# EAGLE design Sequencer_RevB (EAGLE 7.3.0)
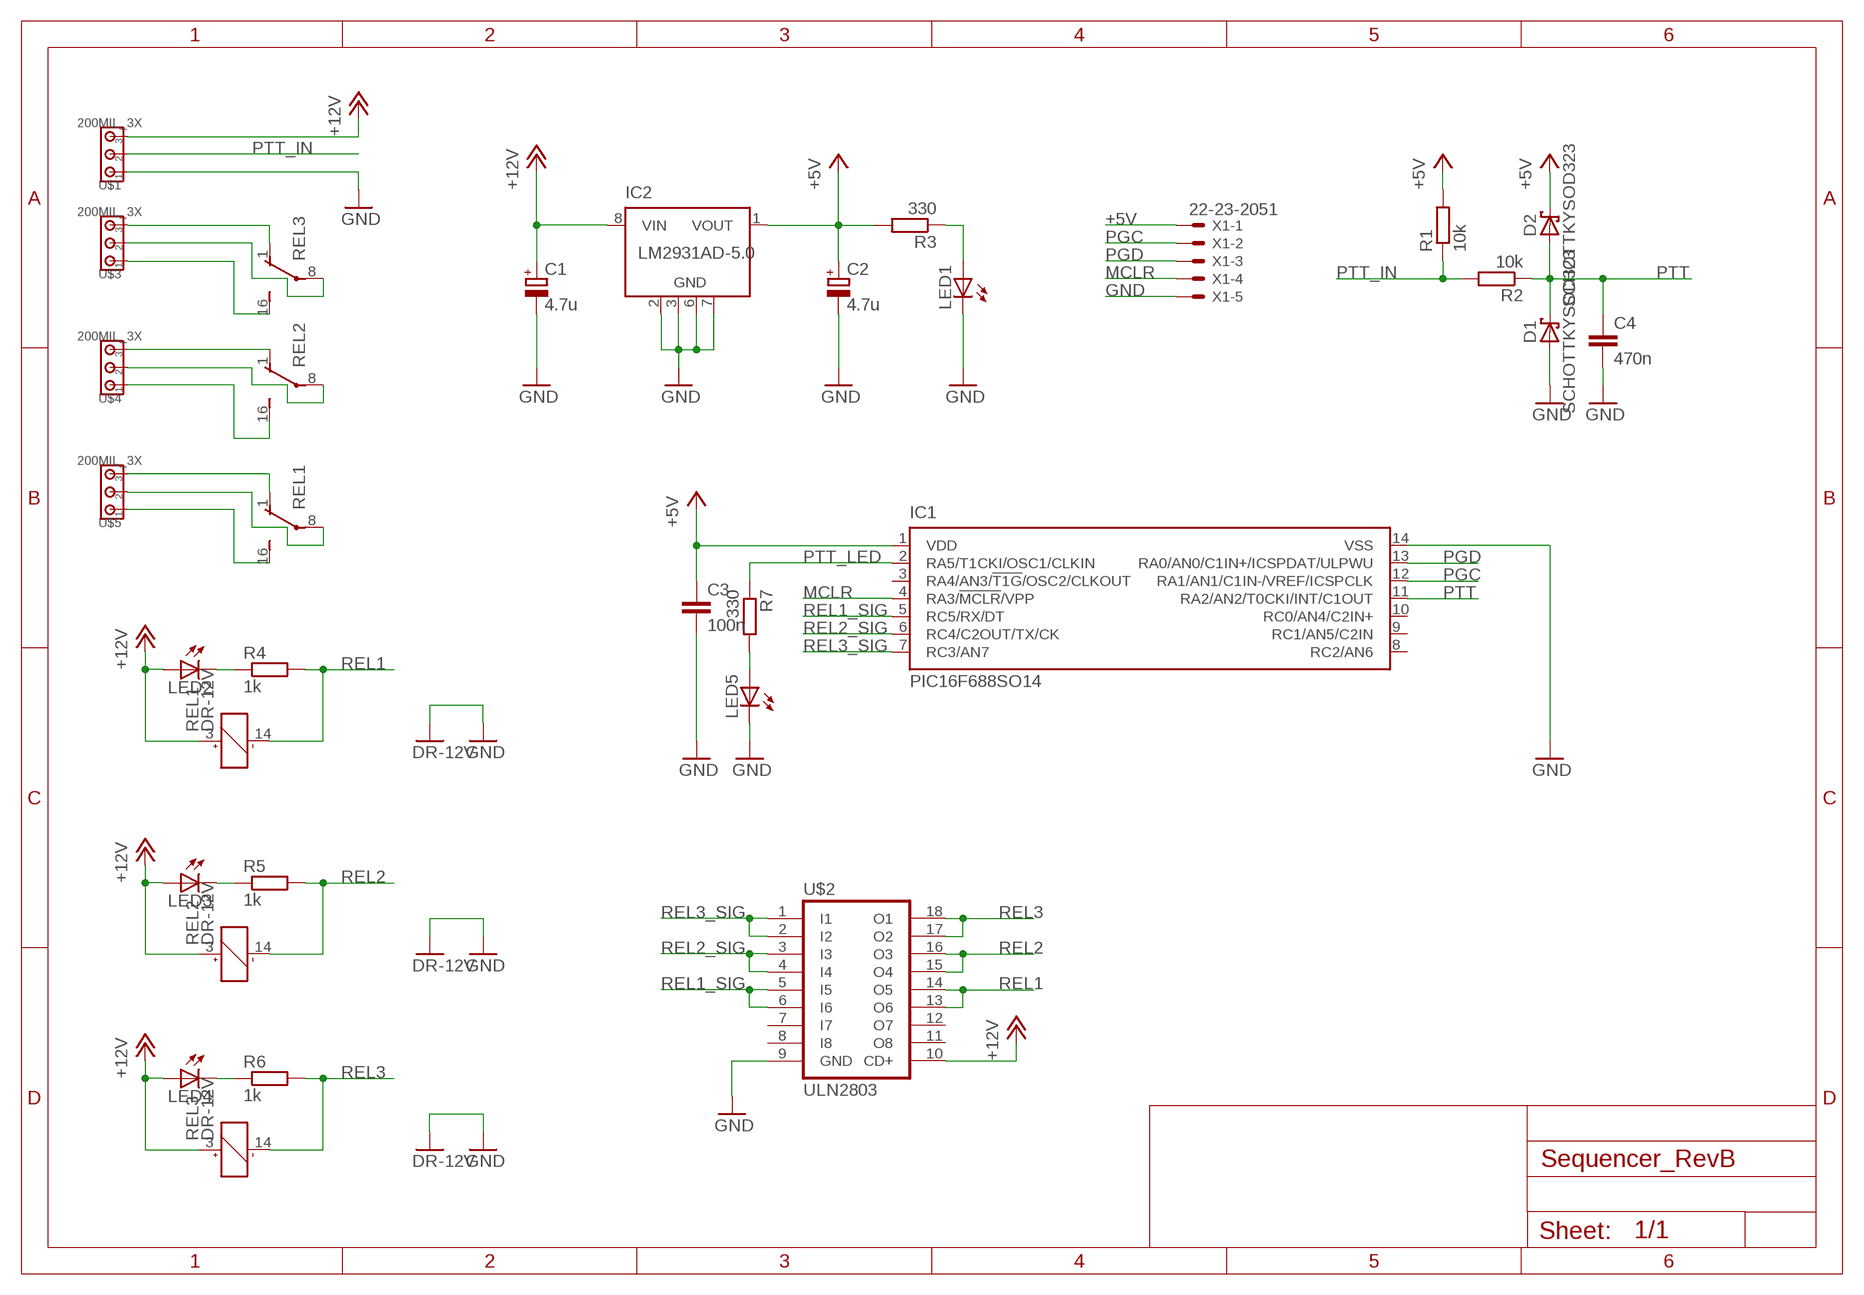
[diagram p0: schematic, sheet 1]

## Parts
C1  4.7u  C_POLARIZEDSMC_C  [SMC_C]
C2  4.7u  C_POLARIZEDSMC_C  [SMC_C]
C3  100n  CC0805  [C0805]
C4  470n  CC0805  [C0805]
D1  SCHOTTKYSOD323  [SOD323]
D2  SCHOTTKYSOD323  [SOD323]
IC1  PIC16F688SO14  [SO14]
IC2  LM2931AD-5.0  [SO8]
LED1  LED0805  [LED0805]
LED2  LED0805  [LED0805]
LED3  LED0805  [LED0805]
LED4  LED0805  [LED0805]
LED5  LED0805  [LED0805]
R1  10k  RESISTORR0805  [R0805]
R2  10k  RESISTORR0805  [R0805]
R3  330  RESISTORR0805  [R0805]
R4  1k  RESISTORR0805  [R0805]
R5  1k  RESISTORR0805  [R0805]
R6  1k  RESISTORR0805  [R0805]
R7  330  RESISTORR0805  [R0805]
REL1  DR-12V  [DR-12V]
REL2  DR-12V  [DR-12V]
REL3  DR-12V  [DR-12V]
U$1  200MIL_3X  [200MIL_3X]
U$2  ULN2803  [SO18W]
U$3  200MIL_3X  [200MIL_3X]
U$4  200MIL_3X  [200MIL_3X]
U$5  200MIL_3X  [200MIL_3X]
X1  22-23-2051  [22-23-2051]

## Nets
+5V: C2.+ C3.1 D2.C IC1.1(VDD) IC2.1(VOUT) R1.2 R3.2 X1.1
+12V: C1.+ IC2.8(VIN) LED2.A LED3.A LED4.A REL1.3(+) REL2.3(+) REL3.3(+) U$1.3 U$2.10(CD+)
GND: C1.- C2.- C3.2 C4.2 D1.A IC1.14(VSS) IC2.2(GND) IC2.3(GND) IC2.6(GND) IC2.7(GND) LED1.C LED5.C REL1.9(GND) REL2.9(GND) REL3.9(GND) U$1.1 U$2.9(GND) X1.5
MCLR: IC1.4(RA3/!MCLR!/VPP) X1.4
N$1: REL2.16(S) U$4.1
N$2: REL2.8(P) U$4.2
N$3: REL2.1(O) U$4.3
N$4: REL3.8(P) U$3.2
N$5: REL1.8(P) U$5.2
N$6: REL1.16(S) U$5.1
N$7: REL3.16(S) U$3.1
N$8: REL3.1(O) U$3.3
N$10: LED1.A R3.1
N$11: LED5.A R7.2
N$12: REL1.1(O) U$5.3
N$13: LED3.C R5.1
N$14: LED2.C R4.1
N$15: LED4.C R6.1
PGC: IC1.12(RA1/AN1/C1IN-/VREF/ICSPCLK) X1.2
PGD: IC1.13(RA0/AN0/C1IN+/ICSPDAT/ULPWU) X1.3
PTT: C4.1 D1.C D2.A IC1.11(RA2/AN2/T0CKI/INT/C1OUT) R2.1
PTT_IN: R1.1 R2.2 U$1.2
PTT_LED: IC1.2(RA5/T1CKI/OSC1/CLKIN) R7.1
REL1: R4.2 REL1.14(-) U$2.13(O6) U$2.14(O5)
REL1_SIG: IC1.5(RC5/RX/DT) U$2.5(I5) U$2.6(I6)
REL2: R5.2 REL2.14(-) U$2.15(O4) U$2.16(O3)
REL2_SIG: IC1.6(RC4/C2OUT/TX/CK) U$2.3(I3) U$2.4(I4)
REL3: R6.2 REL3.14(-) U$2.17(O2) U$2.18(O1)
REL3_SIG: IC1.7(RC3/AN7) U$2.1(I1) U$2.2(I2)
Unconnected: IC1.3(RA4/AN3/!T1G!/OSC2/CLKOUT) IC1.8(RC2/AN6) IC1.9(RC1/AN5/C2IN) IC1.10(RC0/AN4/C2IN+) U$2.7(I7) U$2.8(I8) U$2.11(O8) U$2.12(O7)

## Library data of the parts
C1 C2 = 00Capacitor:C_POLARIZED
C3 C4 = 00Capacitor:C: Capacitor
D1 D2 = 00Diode:SCHOTTKY
IC1 = 00MyParts:PIC16F688
IC2 = 00VoltageRegulator:LM2931*
LED1-LED5 = 00Display:LED: LED
R1-R7 = 00Resistor:RESISTOR: RESISTOR, European symbol
REL1-REL3 = 00MyParts:DR-12V
U$1 U$3-U$5 = 00Connector:200MIL_3X: 200mil connector
U$2 = 00MyParts:ULN2803
X1 = 00MyParts:22-23-2051: .100" (2.54mm) Center Header - 5 Pin; MF: MOLEX; MPN: 22-23-2051; OC_FARNELL: 1462952; OC_NEWARK: 38C9178

## Board
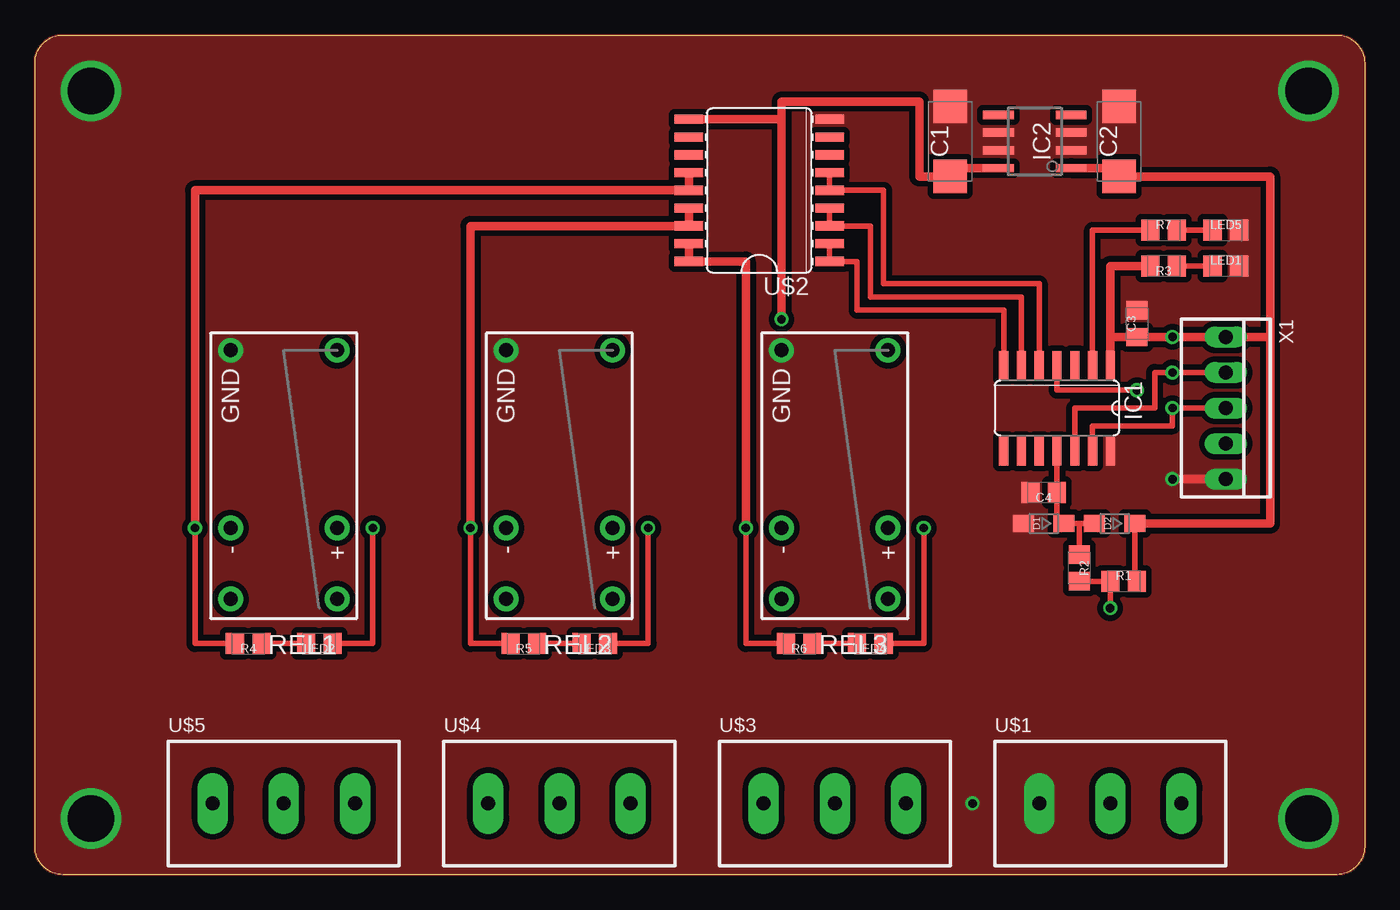
[diagram p1: board, top side]
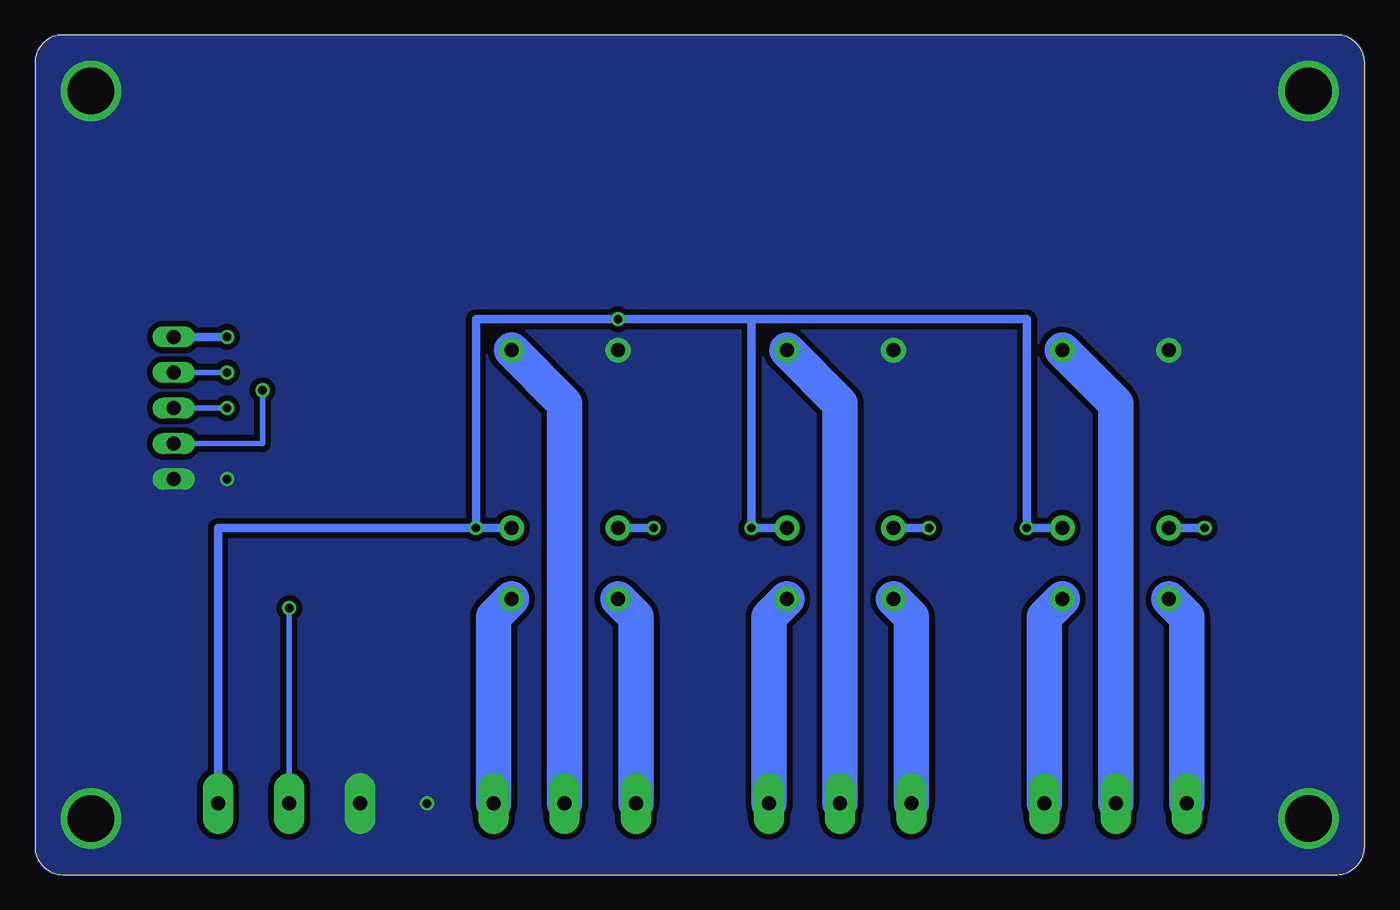
[diagram p2: board, bottom side, seen from below]

Size 95 x 60 mm. Coordinates in mm from the lower left corner, seen from the top.
Outline: 0,58 arc-90 2,60 93,60 arc-90 95,58 95,2 arc-90 93,0 2,0 arc-90 0,2 0,58
Copper layers (1*16): Top 0.035mm / dielectric 1.5mm / Bottom 0.035mm
Design rules "default *": minimum track width 10mil, minimum drill 0.6mm, track to track 16mil, track to pad 16mil, pad to pad 16mil, via to via 16mil, smd to smd 16mil, copper to edge 0mil, drill to drill 8mil, minimum pad ring 10mil, minimum via ring 8mil, stop-mask expansion 4mil, vias tented up to drill 0mil, thermal gap 10mil

### Footprints (pad centres in the part's own frame; a part is rotated, then mirrored left to right if it is on the bottom)
SMC_C = smd 2.4 x 2.4: + -2.5,0; - 2.5,0
C0805 = smd 1.3 x 1.5: 1 -0.95,0; 2 0.95,0
SOD323 = smd 1.5 x 1.2: A 1.45,0; C -1.45,0
SO14 = smd 0.66 x 2.032: 1 -3.81,-3.073; 2 -2.54,-3.073; 3 -1.27,-3.073; 4 0,-3.073; 5 1.27,-3.073; 6 2.54,-3.073; 7 3.81,-3.073; 8 3.81,3.073; 9 2.54,3.073; 10 1.27,3.073; 11 0,3.073; 12 -1.27,3.073; 13 -2.54,3.073; 14 -3.81,3.073
SO8 = smd 2.2 x 0.6: 1 -2.6,1.905; 2 -2.6,0.635; 3 -2.6,-0.635; 4 -2.6,-1.905; 5 2.6,-1.905; 6 2.6,-0.635; 7 2.6,0.635; 8 2.6,1.905
LED0805 = smd 1.3 x 1.5: A -0.95,0; C 0.95,0
R0805 = smd 1.3 x 1.5: 1 -0.95,0; 2 0.95,0
DR-12V = drill 1 pad 1.778: 1 -8.89,-3.81; 3 -3.81,-3.81; 8 8.89,-3.81; 9 8.89,3.81; 14 -3.81,3.81; 16 -8.89,3.81
200MIL_3X = drill 1 pad 2.184 long: 1 -5.08,0; 2 0,0; 3 5.08,0
SO18W = smd 0.66 x 2.032: 1 -5.08,-5.029; 2 -3.81,-5.029; 3 -2.54,-5.029; 4 -1.27,-5.029; 5 0,-5.029; 6 1.27,-5.029; 7 2.54,-5.029; 8 3.81,-5.029; 9 5.08,-5.029; 10 5.08,5.029; 11 3.81,5.029; 12 2.54,5.029; 13 1.27,5.029; 14 0,5.029; 15 -1.27,5.029; 16 -2.54,5.029; 17 -3.81,5.029; 18 -5.08,5.029
22-23-2051 = drill 1 long: 1 -5.08,0; 2 -2.54,0; 3 0,0; 4 2.54,0; 5 5.08,0

### Placement (x,y rotation side)
C1  65.41,52.39 90 top
C2  77.47,52.39 90 top
C3  78.74,39.37 90 top
C4  72.07,27.3 180 top
D1  72.07,25.08 180 top
D2  77.15,25.08 180 top
IC1  73.03,33.34 180 top
IC2  71.44,52.39 180 top
LED1  85.09,43.5 0 top
LED2  20.32,16.51 180 top
LED3  40.01,16.51 180 top
LED4  59.69,16.51 180 top
LED5  85.09,46.04 0 top
R1  77.79,20.95 0 top
R2  74.61,21.91 270 top
R3  80.64,43.5 180 top
R4  15.24,16.51 180 top
R5  34.92,16.51 180 top
R6  54.61,16.51 180 top
R7  80.64,46.04 0 top
REL1  17.78,28.57 90 top
REL2  37.47,28.57 90 top
REL3  57.15,28.57 90 top
U$1  76.83,5.08 0 top
U$2  51.75,48.9 90 top
U$3  57.15,5.08 0 top
U$4  37.47,5.08 0 top
U$5  17.78,5.08 0 top
X1  85.09,33.34 270 top

### Tracks (layer width: path | path; a pad name or v marks a point on that pad's centre or on a via)
+5V  (via drill 0.6)
  Top 0.406: R1.2 78.6,20.95 D2.C
  Top 0.61: X1.1 v81.28,38.42 C3.1 76.83,38.42 | X1.1 85.72,38.42 | IC1.1 76.83,38.42 | R3.2 76.83,43.5 76.83,38.42 | IC2.1 77.47,50.48 C2.+ 88.27,49.89 88.27,38.42 | D2.C 88.27,25.08 88.27,38.42 | 88.27,38.42 X1.1
  Bottom 0.61: X1.1 v81.28,38.42
+12V  (via drill 0.6)
  Top 0.406: v24.13,24.77 24.13,16.51 LED2.A | LED3.A 43.81,16.51 v43.81,24.77 | LED4.A 63.5,16.51 v63.5,24.77
  Top 0.61: IC2.8 65.41,50.48 C1.+ 63.18,49.89 63.18,55.24 53.34,55.24 53.34,53.98 | U$2.10 53.34,53.98 | 53.34,53.98 v53.34,39.69
  Bottom 0.61: REL1.3 v24.13,24.77 24.13,39.69 43.81,39.69 | REL2.3 v43.81,24.77 43.81,39.69 | REL3.3 v63.5,24.77 | v63.5,24.77 63.5,39.69 v53.34,39.69 43.81,39.69 | U$1.3 81.92,24.77 v63.5,24.77
GND  (via drill 0.6, 3.3)
  Top 0.61: X1.5 v81.28,28.26
  other vias: 4,56 91,4 4,4 91,56 66.99,5.08
  pour Bottom (isolate 0.406, no thermals): 2,60 93,60 arc-90 95,58 95,2 arc-90 93,0 2,0 arc-90 0,2 0,58 arc-90
  pour Top (isolate 0.406, rank 2, no thermals): 2,60 93,60 arc-90 95,58 95,2 arc-90 93,0 2,0 arc-90 0,2 0,58 arc-90
MCLR  (via drill 0.6)
  Top 0.406: IC1.4 73.03,34.61 v78.74,34.61
  Bottom 0.406: X1.4 78.74,30.8 v78.74,34.61
N$1
  Bottom 2.54: REL2.16 32.38,18.41 U$4.1
N$2
  Bottom 2.54: REL2.8 37.47,33.66 U$4.2
N$3
  Bottom 2.54: REL2.1 42.55,18.41 U$4.3
N$4
  Bottom 2.54: REL3.8 57.15,33.66 U$3.2
N$5
  Bottom 2.54: REL1.8 17.78,33.66 U$5.2
N$6
  Bottom 2.54: REL1.16 12.7,18.41 U$5.1
N$7
  Bottom 2.54: REL3.16 52.07,18.41 U$3.1
N$8
  Bottom 2.54: REL3.1 62.23,18.41 U$3.3
N$10
  Top 0.406: LED1.A R3.1
N$11
  Top 0.406: LED5.A R7.2
N$12
  Bottom 2.54: REL1.1 22.86,18.41 U$5.3
N$13
  Top 0.406: LED3.C R5.1
N$14
  Top 0.406: LED2.C R4.1
N$15
  Top 0.406: R6.1 LED4.C
PGC  (via drill 0.6)
  Top 0.406: X1.2 v81.28,35.88 80.01,35.88 80.01,33.34 74.3,33.34 IC1.12
  Bottom 0.406: v81.28,35.88 X1.2
PGD  (via drill 0.6)
  Top 0.406: X1.3 v81.28,33.34 81.28,32.07 75.56,32.07 IC1.13
  Bottom 0.406: X1.3 v81.28,33.34
PTT
  Top 0.406: D2.A 74.61,25.08 | 74.61,25.08 D1.C arc-90 73.02,25.58 C4.1 IC1.11 | R2.1 74.61,25.08
PTT_IN  (via drill 0.6)
  Top 0.406: R2.2 R1.1 v76.83,19.05
  Bottom 0.406: U$1.2 v76.83,19.05
PTT_LED
  Top 0.406: IC1.2 75.56,46.04 R7.1
REL1  (via drill 0.6)
  Top 0.406: R4.2 11.43,16.51 v11.43,24.77
  Top 0.61: U$2.13 U$2.14 11.43,48.9 v11.43,24.77
  Bottom 0.61: REL1.14 v11.43,24.77
REL1_SIG
  Top 0.406: U$2.6 U$2.5 60.64,48.9 60.64,42.23 71.75,42.23 IC1.5
REL2  (via drill 0.6)
  Top 0.406: R5.2 31.11,16.51 v31.11,24.77
  Top 0.61: U$2.15 U$2.16 31.11,46.35 v31.11,24.77
  Bottom 0.61: REL2.14 v31.11,24.77
REL2_SIG
  Top 0.406: U$2.4 U$2.3 59.69,46.35 59.69,41.27 70.48,41.27 IC1.6
REL3  (via drill 0.6)
  Top 0.406: R6.2 50.8,16.51 v50.8,24.77
  Top 0.61: U$2.17 U$2.18 50.8,43.81 v50.8,24.77
  Bottom 0.61: REL3.14 v50.8,24.77
REL3_SIG
  Top 0.406: U$2.2 U$2.1 58.74,43.81 58.74,40.32 69.22,40.32 IC1.7

### Text on the board
tText: PTT | PWR | VCC | PGC | PGD | CLR | Sequencer | Lukas Fässler 2015 | GND | Rel1 | Rel2 | Rel3 | GND | PTT | 12V